# EAGLE design 14DoF MPU9150 (EAGLE 6.2)
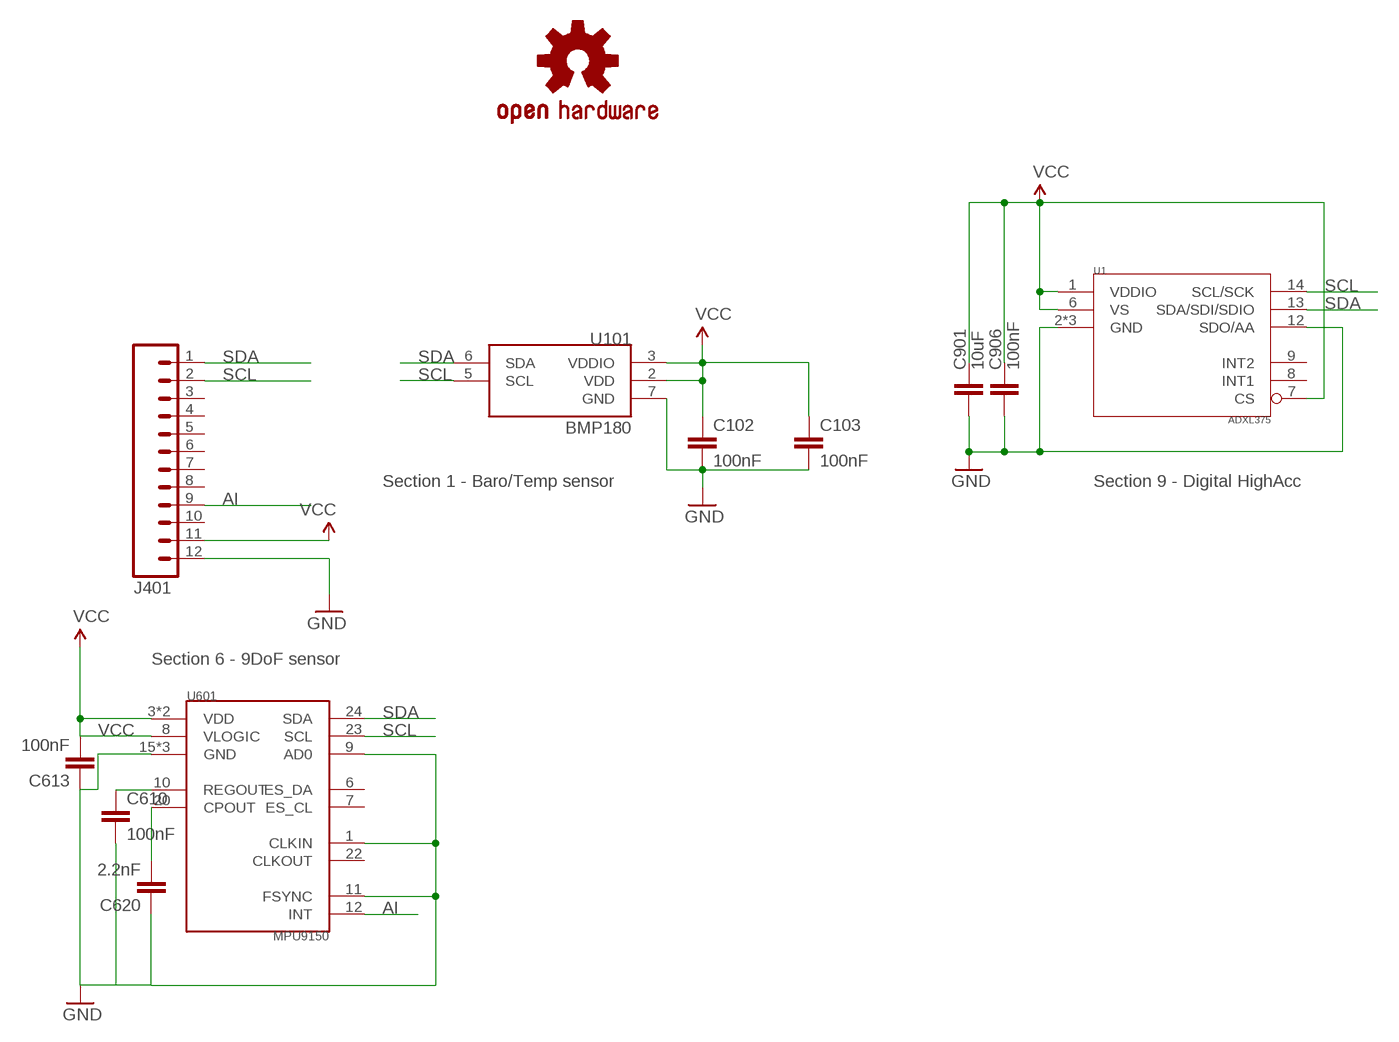
[diagram p0: schematic, sheet 1]

## Parts
C102  100nF  CAP0603-CAP  [0603-CAP]
C103  100nF  CAP0603-CAP  [0603-CAP]
C610  100nF  CAP0603-CAP  [0603-CAP]
C613  100nF  CAP0603-CAP  [0603-CAP]
C620  2.2nF  CAP0603-CAP  [0603-CAP]
C901  10uF  CAP0603-CAP  [0603-CAP]
C906  100nF  CAP0402-CAP  [0402-CAP]
J401  M12PTH  [1X12]
U1  ADXL375  [ADXL375]
U101  BMP180  [BMP180]
U601  MPU9150  [LLGA24]
U$2  OSHW-LOGOS  [OSHW-LOGO-S]

## Nets
AI: J401.9 U601.12(INT)
GND: C102.2 C103.2 C610.2 C613.1 C620.1 C901.2 C906.2 J401.12 U1.2(GND) U1.4(GND) U1.5(GND) U1.12(SDO/AA) U101.7(GND) U601.1(CLKIN) U601.9(AD0) U601.11(FSYNC) U601.15(GND) U601.17(GND) U601.18(GND)
N$1: C610.1 U601.10(REGOUT)
N$3: C620.2 U601.20(CPOUT)
SCL: J401.2 U1.14(SCL/SCK) U101.5(SCL) U601.23(SCL)
SDA: J401.1 U1.13(SDA/SDI/SDIO) U101.6(SDA) U601.24(SDA)
VCC [power]: C102.1 C103.1 C613.2 C901.1 C906.1 J401.11 U1.1(VDDIO) U1.6(VS) U1.7(CS) U101.2(VDD) U101.3(VDDIO) U601.3(VDD) U601.8(VLOGIC) U601.13(VDD)
Unconnected: J401.3 J401.4 J401.5 J401.6 J401.7 J401.8 J401.10 U1.8(INT1) U1.9(INT2) U601.6(ES_DA) U601.7(ES_CL) U601.22(CLKOUT)

## Notes on the sheet
- Section 1 - Baro/Temp sensor | Section 9 - Digital HighAcc
- Section 6 - 9DoF sensor

## Library data of the parts
C102 C103 C610 C613 = SparkFun:CAP: Capacitor Standard 0603 ceramic capacitor, and 0.1" leaded capacitor.; DIGIKEY: 445-1317-2-ND
C620 = SparkFun:CAP: Capacitor Standard 0603 ceramic capacitor, and 0.1" leaded capacitor.; DIGIKEY: 445-1309-2-ND
C901 = SparkFun:CAP: Capacitor Standard 0603 ceramic capacitor, and 0.1" leaded capacitor.; DIGIKEY: 445-7486-1-ND
C906 = SparkFun-Passives:CAP: Capacitor Standard 0603 ceramic capacitor, and 0.1" leaded capacitor.; DIGIKEY: 445-1265-1-ND
J401 = SparkFun:M12: Header 12 Standard 12-pin 0.1" header. Use with straight break away headers (SKU : PRT-00116), right angle break away headers (PRT-00553), swiss pins (PRT-00743), machine pins (PRT-00117), and female headers (PRT-00115).; DIGIKEY: $NOPART
U1 = KwanSystems:ADXL375; DIGIKEY: ADXL375BCCZ-ND
U101 = KwanSystems:BMP180; DIGIKEY: 828-1027-1-ND
U601 = KwanSystems:MPU9150
U$2 = SparkFun:OSHW-LOGO: Open Source Hardware Logo This logo indicates the piece of hardware it is found on incorporates a OSHW license and/or adheres to the definition of open source hardware found here: http://freedomdefined.org/OSHW; DIGIKEY: $NOPART

## Net classes
0 default: width 0.152 mm, drill 0.33 mm, clearance 0.152 mm
1 power: width 0.152 mm, drill 0.33 mm, clearance 0.152 mm to class 0, clearance 0.152 mm
2 hv: width 0.152 mm, drill 0.33 mm, clearance 0.152 mm

## Board
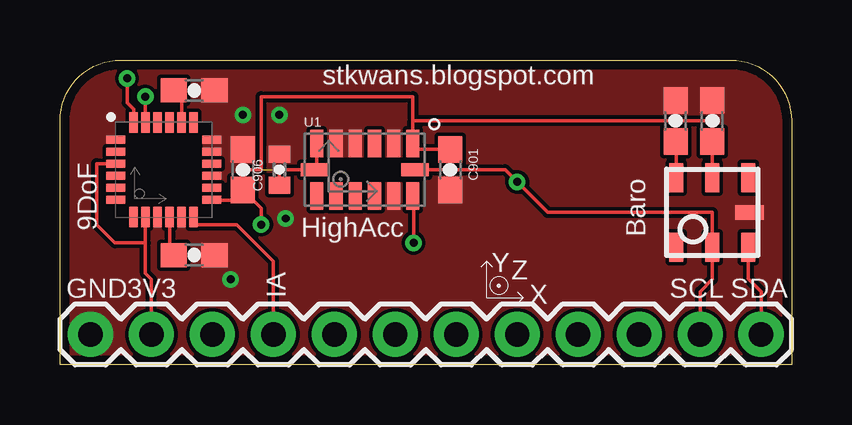
[diagram p1: board, top side]
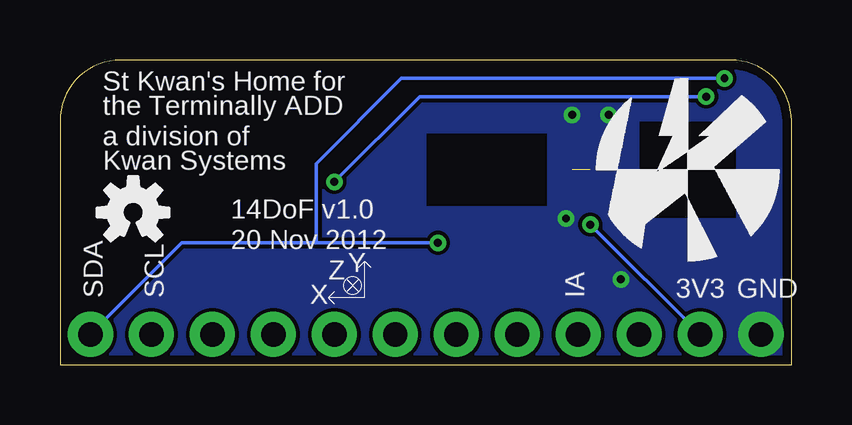
[diagram p2: board, bottom side, seen from below]

Size 30.48 x 12.7 mm. Coordinates in mm from the lower left corner, seen from the top.
Outline: 0,0 0,10.16 arc-90 2.54,12.7 27.94,12.7 arc-90 30.48,10.16 30.48,0 0,0
Copper layers (1*16): Top 0.0356mm / dielectric 1.5011mm / Bottom 0.0356mm
Design rules: minimum track width 6mil, minimum drill 13mil, track to track 6mil, track to pad 6mil, pad to pad 6mil, via to via 6mil, smd to smd 6mil, copper to edge 15mil, drill to drill 6mil, minimum pad ring 7mil, minimum via ring 7mil, stop-mask expansion 4mil, vias tented up to drill 14mil, thermal gap 10mil
vRestrict: area 0.8,2.8 to 1.8,4.8; area 3.3,2.8 to 4.3,4.8; area 5.8,2.8 to 6.9,4.8; area 8.4,2.8 to 9.4,3.8; area 10.9,2.8 to 11.7,5.3; area 12.7,2.8 to 15.2,3.6; area 13.5,3.6 to 14.2,5.3; area 15.5,2.8 to 18,3.6; area 18.5,2.8 to 19.6,3.8; area 20.6,2.8 to 22.6,3.6; area 21.1,3.6 to 21.8,4.8; area 23.6,2.8 to 24.4,3.8; 19 more areas

### Footprints (pad centres in the part's own frame; a part is rotated, then mirrored left to right if it is on the bottom)
0603-CAP = smd 1.1 x 1: 1 -0.85,0; 2 0.85,0
0402-CAP = smd 0.7 x 0.9: 1 -0.65,0; 2 0.65,0
1X12 = drill 1.016 pad 1.88: 1 0,0; 2 2.54,0; 3 5.08,0; 4 7.62,0; 5 10.16,0; 6 12.7,0; 7 15.24,0; 8 17.78,0; 9 20.32,0; 10 22.86,0; 11 25.4,0; 12 27.94,0
ADXL375 = smd 0.55 x 1.145: 1 2,1.097; 2 1.2,1.097; 3 0.4,1.097; 4 -0.4,1.097; 5 -1.2,1.097; 6 -2,1.097; 8 -2,-1.097; 9 -1.2,-1.097; 10 -0.4,-1.097; 11 0.4,-1.097; 12 1.2,-1.097; 13 2,-1.097 | smd 1.145 x 0.55: 7 -2.098,0; 14 2.098,0
BMP180 = smd 0.6 x 1.2: 1 1.5,1.45; 2 0,1.45; 3 -1.5,1.45; 4 -1.5,-1.45; 5 0,-1.45; 6 1.5,-1.45 | smd 1.2 x 0.6: 7 1.55,0
LLGA24 = smd 0.8 x 0.35: 1 -2,1.25; 2 -2,0.75; 3 -2,0.25; 4 -2,-0.25; 5 -2,-0.75; 6 -2,-1.25; 13 2,-1.25; 14 2,-0.75; 15 2,-0.25; 16 2,0.25; 17 2,0.75; 18 2,1.25 | smd 0.35 x 0.85: 7 -1.25,-1.975; 8 -0.75,-1.975; 9 -0.25,-1.975; 10 0.25,-1.975; 11 0.75,-1.975; 12 1.25,-1.975; 19 1.25,1.975; 20 0.75,1.975; 21 0.25,1.975; 22 -0.25,1.975; 23 -0.75,1.975; 24 -1.25,1.975

### Placement (x,y rotation side)
C102  27.18,10.16 90 top
C103  25.65,10.16 90 top
C610  5.59,4.57 0 top
C613  7.62,8.13 270 top
C620  5.59,11.43 180 top
C901  16.26,8.13 270 top
C906  9.14,8.13 90 top
J401  29.21,1.27 180 top
U1  12.7,8.13 0 top
U101  27.18,6.35 0 top
U601  4.32,8.13 0 top
U$1  [KWAN_ACC]  4.32,8.13 0 bottom
U$2  27.43,6.35 0 bottom
U$3  [AXES_SM]  17.78,2.79 0 top

### Tracks (layer width: path | path; a pad name or v marks a point on that pad's centre or on a via)
AI
  Top 0.152: U601.12 5.59,6.13 5.59,5.84 7.37,5.84 8.89,4.32 J401.9
GND  (via drill 0.33)
  other vias: 7.11,3.56 9.4,6.1 9.14,10.41 7.62,10.41
  pour Top (no thermals): 2.54,12.7 27.94,12.7 arc-90 30.48,10.16 30.48,0 0,0 0,10.16 arc-90
  pour Bottom (no thermals): 2.54,12.7 27.94,12.7 arc-90 30.48,10.16 30.48,0 0,0 0,10.16 arc-90
N$1
  Top 0.152: U601.10 4.57,4.74 C610.1
N$3
  Top 0.152: U601.20 5.07,11.43 C620.2
SCL  (via drill 0.33)
  Top 0.152: J401.2 26.67,3.05 27.18,3.56 U101.5 27.18,6.35 20.32,6.35 v19.05,7.62 18.54,8.13 U1.14 | v3.56,11.18 3.56,10.1 U601.23
  Bottom 0.152: v3.56,11.18 15.49,11.18 v19.05,7.62
SDA  (via drill 0.33)
  Top 0.152: U101.6 28.68,3.58 29.21,3.05 J401.1 | v2.79,11.94 2.79,10.92 3.07,10.65 U601.24 | v14.73,5.08 14.73,7.03 U1.13
  Bottom 0.152: v2.79,11.94 16.26,11.94 19.81,8.38 19.81,5.08 | J401.1 25.4,5.08 20.07,5.08 19.81,5.08 | 19.81,5.08 v14.73,5.08
VCC  (via drill 0.33)  (1 unrouted)
  Top 0.152: U101.2 C102.1 27.18,10.16 25.65,10.16 | U101.3 25.68,9.29 C103.1 25.65,10.16 | 25.65,10.16 14.7,10.16 | J401.11 3.81,3.56 3.56,3.81 3.56,5.08 | 3.56,5.08 3.56,6.14 U601.8 | 3.56,5.08 2.29,5.08 1.52,5.84 1.52,8.38 U601.3 | C613.2 7.62,8.13 8.38,8.13 8.38,11.18 14.7,11.18 14.7,10.16 | U601.13 6.32,6.86 7.62,6.86 C613.2 | C906.1 9.14,8.13 U1.7 10.7,8.13 U1.6 | C901.1 14.7,8.98 U1.1 14.7,10.16 | v8.38,5.84 8.38,6.52 C613.2
  Bottom 0.152: J401.11 v8.38,5.84

### Text on the board
tPlace: stkwans.blogspot.com | 9DoF | HighAcc | Baro | GND | 3V3 | IA | SCL | SDA
bPlace: St Kwan's Home for | the Terminally ADD | a division of | Kwan Systems | 14DoF v1.0 | 20 Nov 2012 | GND | 3V3 | IA | SCL | SDA